# Altium schematic sheet LAN8742AI-CZ-TR.SchDoc
size A4; SheetNumber: 13; SheetTotal: 14
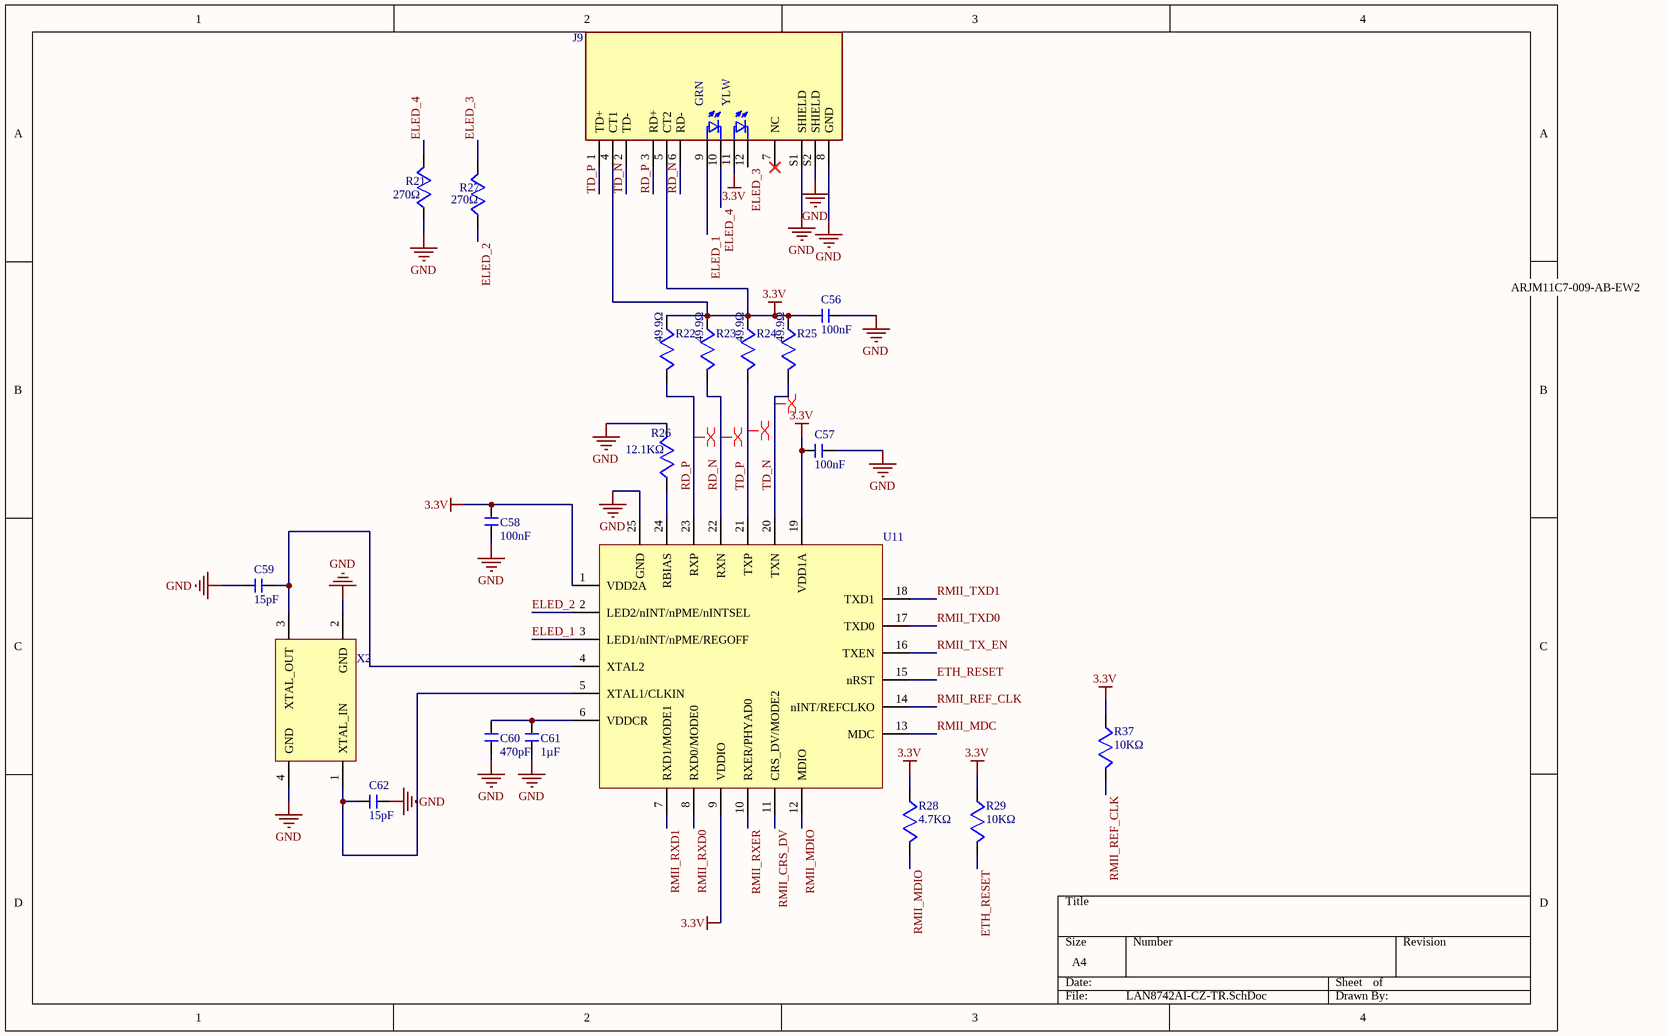
[diagram p0: LAN8742AI-CZ-TR.SchDoc]

## Parts
C56  value 100nF  [402 capacitor - duplicate]  (hidden comment: 0402 capacitor)
C57  value 100nF  [402 capacitor - duplicate]  (hidden comment: 0402 capacitor)
C58  value 100nF  [402 capacitor - duplicate]  (hidden comment: 0402 capacitor)
C59  value 15pF  [402 capacitor - duplicate]  (hidden comment: 0402 capacitor)
C60  value 470pF  [402 capacitor - duplicate]  (hidden comment: 0402 capacitor)
C61  value 1µF  [402 capacitor - duplicate]  (hidden comment: 0402 capacitor)
C62  value 15pF  [402 capacitor - duplicate]  (hidden comment: 0402 capacitor)
J9  ARJM11C7-009-AB-EW2  [ARJM11C7-009-AB-EW2]  (value not drawn)
R21  value 270Ω  [402 RESISTOR]  (hidden comment: 0402. RESİSTOR)
R22  value 49.9Ω  [402 RESISTOR]  (hidden comment: 0402. RESİSTOR)
R23  value 49.9Ω  [402 RESISTOR]  (hidden comment: 0402. RESİSTOR)
R24  value 49.9Ω  [402 RESISTOR]  (hidden comment: 0402. RESİSTOR)
R25  value 49.9Ω  [402 RESISTOR]  (hidden comment: 0402. RESİSTOR)
R26  value 12.1KΩ  [603 resistor]  (hidden comment: 0603 RESİSTOR)
R27  value 270Ω  [402 RESISTOR]  (hidden comment: 0402. RESİSTOR)
R28  value 4.7KΩ  [402 RESISTOR]  (hidden comment: 0402. RESİSTOR)
R29  value 10KΩ  [402 RESISTOR]  (hidden comment: 0402. RESİSTOR)
R37  value 10KΩ  [402 RESISTOR]  (hidden comment: 0402. RESİSTOR)
U11  LAN8742AI-CZ-TR  [LAN8742AI-CZ-TR]  (value not drawn)
X2  RH100-25.000-10-F-1010-EXT-TR  [RH100-25.000-10-F-1010-EXT-TR]  (value not drawn)

## Nets
3.3V: C56.1 C57.2 C58.2 J9.4(CT1) J9.5(CT2) J9.11 R22.1 R23.1 R24.1 R25.1 R28.1 R29.1 R37.1 U11.1(VDD2A) U11.9(VDDIO) U11.19(VDD1A)
GND: C56.2 C57.1 C58.1 C59.1 C60.1 C61.1 C62.1 J9.8(GND) J9.S1(SHIELD) J9.S2(SHIELD) R21.1 R26.2 U11.25(GND) X2.2(GND) X2.4(GND)
ELED_1: J9.9 U11.3(LED1/nINT/nPME/REGOFF)
ELED_2: R27.1 U11.2(LED2/nINT/nPME/nINTSEL)
ELED_3: J9.12 R27.2
ELED_4: J9.10 R21.2
ETH_RESET: R29.2 U11.15(nRST)
RD_N: J9.6(RD-) R23.2 U11.22(RXN)
RD_P: J9.3(RD+) R22.2 U11.23(RXP)
RMII_CRS_DV: U11.11(CRS_DV/MODE2)
RMII_MDC: U11.13(MDC)
RMII_MDIO: R28.2 U11.12(MDIO)
RMII_REF_CLK: R37.2 U11.14(nINT/REFCLKO)
RMII_RXD0: U11.8(RXD0/MODE0)
RMII_RXD1: U11.7(RXD1/MODE1)
RMII_RXER: U11.10(RXER/PHYAD0)
RMII_TX_EN: U11.16(TXEN)
RMII_TXD0: U11.17(TXD0)
RMII_TXD1: U11.18(TXD1)
TD_N: J9.2(TD-) R25.2 U11.20(TXN)
TD_P: J9.1(TD+) R24.2 U11.21(TXP)
NetC59_2: C59.2 U11.4(XTAL2) X2.3(XTAL_OUT)
NetC60_2: C60.2 C61.2 U11.6(VDDCR)
NetC62_2: C62.2 U11.5(XTAL1/CLKIN) X2.1(XTAL_IN)
NetR26_1: R26.1 U11.24(RBIAS)

Not connected (* = marked no-connect by the designer): J9 7(NC)*

## Layout directives
differential pair; net class ETH_TX; differential pair class DIF_100: RD_N, RD_P, TD_N, TD_P

## Notes on the sheet
- ARJM11C7-009-AB-EW2
- (in symbol ARJM11C7-009-AB-EW2) GRN; YLW

## Library data of the parts
C56-C58 = CAP SMD 402: MPN: CL05A104KA5NNNC; Package: 0402
C59 C62 = CAP SMD 402: MPN: GRM1555C1H150JA01D; Package: 0402
C60 = CAP SMD 402: MPN: GRM1555C1H471JA01D; Package: 0402
C61 = CAP SMD 402: MPN: GRM155R6YA105KE11D; Package: 0402
J9 = ARJM11C7-009-AB-EW2: CONN JACK 1PORT PCB; MPN: ARJM11C7-009-AB-EW2
R21 R27 = RES SMD 0402: MPN: RMCF0402FT270R; Package: 0402
R22-R25 = RES SMD 0402: MPN: RG1005N-49R9-W-T1; Package: 0402
R26 = RES SMD 0603: MPN: RT0603BRD0712K1L; Package: 0603
R28 = RES SMD 0402: MPN: RMCF0402FT4K70; Package: 0402
R29 R37 = RES SMD 0402: MPN: RNCF0402BTE10K0; Package: 0402
U11 = LAN8742AI-CZ-TR: IC TRANSCEIVER FULL 1/1 24SQFN; MPN: LAN8742AI-CZ-TR
X2 = RH100-25.000-10-F-1010-EXT-TR: CRYSTAL 25.0000MHZ 10PF SMD; MPN: RH100-25.000-10-F-1010-EXT-TR